# EAGLE design dual-channel-buck-v0 (EAGLE 5.07)

## Sheet 1 of 2
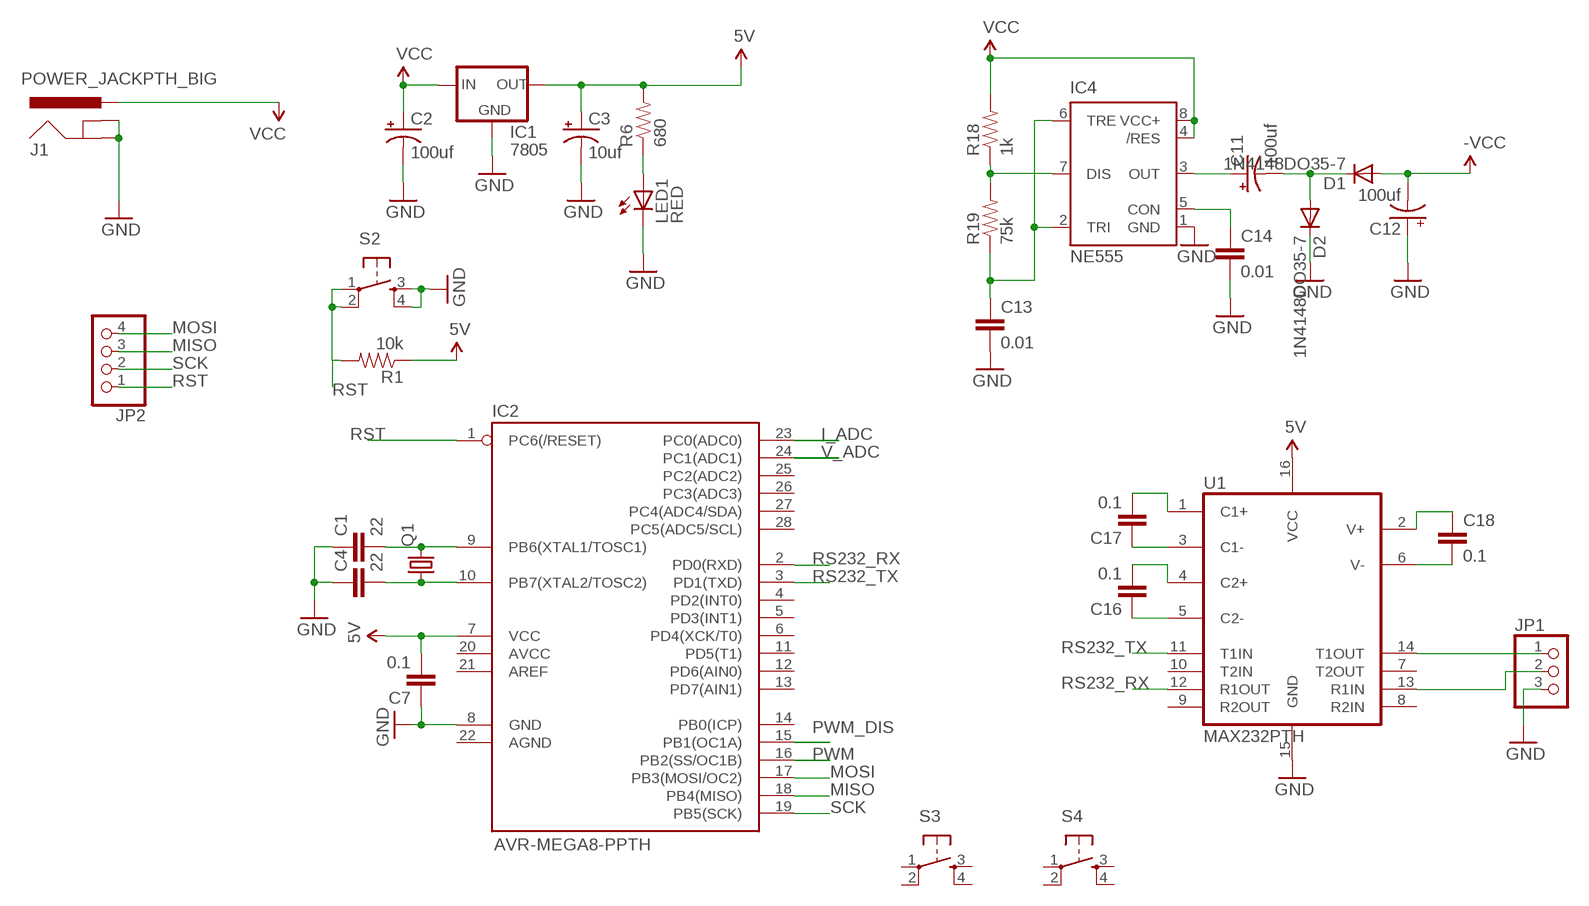
[diagram p0: schematic, sheet 1]

### Parts
C1  22  CAP0805  [0805]
C2  100uf  CAP_POLPTH1  [CPOL-RADIAL-100UF-25V]
C3  10uf  CAP_POLPTH2  [CPOL-RADIAL-10UF-25V]
C4  22  CAP0805  [0805]
C7  0.1  CAP0805  [0805]
C11  100uf  CAP_POLPTH1  [CPOL-RADIAL-100UF-25V]
C12  100uf  CAP_POLPTH1  [CPOL-RADIAL-100UF-25V]
C13  0.01  CAP0805  [0805]
C14  0.01  CAP0805  [0805]
C16  0.1  CAP0805  [0805]
C17  0.1  CAP0805  [0805]
C18  0.1  CAP0805  [0805]
D1  1N4148DO35-7  [DO35-7]
D2  1N4148DO35-7  [DO35-7]
IC1  7805  V_REG_78XXSIDE  [78XXL]
IC2  AVR-MEGA8-PPTH  [DIL28-3]
IC4  NE555  [DIL-08]
J1  POWER_JACKPTH_BIG  [POWER_JACK_2.1X5.5_BIG_PTH]
JP1  PINHD-1X3  [1X03]
JP2  PINHD-1X4  [1X04]
LED1  RED  LED3MM  [LED3MM]
Q1  CRYSTALHC49US  [HC49US]
R1  10k  RESISTOR  [0805]
R6  680  RESISTOR  [0805]
R18  1k  RESISTOR  [0805]
R19  75k  RESISTOR  [0805]
S2  TAC_SWITCHPTH  [TACTILE-PTH]
S3  TAC_SWITCHPTH  [TACTILE-PTH]
S4  TAC_SWITCHPTH  [TACTILE-PTH]
U1  MAX232PTH  [DIL16]

### Nets
5V: C3.1(+) C7.2 IC1.OUT IC2.7(VCC) R1.1 R6.2 U1.16(VCC)
-VCC: C12.2(-) D1.A ; also sheet 2
GND: C1.1 C2.2(-) C3.2(-) C4.1 C7.1 C12.1(+) C13.2 C14.2 D2.C IC1.GND IC2.8(GND) IC4.1(GND) J1.GND J1.GNDBREAK JP1.3 LED1.K(C) S2.3 S2.4 U1.15(GND) ; also sheet 2
I_ADC: IC2.23(PC0(ADC0)) ; also sheet 2
MISO: IC2.18(PB4(MISO)) JP2.3
MOSI: IC2.17(PB3(MOSI/OC2)) JP2.4
N$2: C1.2 IC2.9(PB6(XTAL1/TOSC1)) Q1.2
N$3: C4.2 IC2.10(PB7(XTAL2/TOSC2)) Q1.1
N$10: LED1.A R6.1
N$11: IC4.7(DIS) R18.1 R19.2
N$12: C13.1 IC4.2(TRI) IC4.6(TRE) R19.1
N$14: C14.1 IC4.5(CON)
N$19: C11.1(+) IC4.3(OUT)
N$23: C11.2(-) D1.C D2.A
N$24: C17.2 U1.1(C1+)
N$25: C17.1 U1.3(C1-)
N$28: C16.2 U1.4(C2+)
N$29: C16.1 U1.5(C2-)
N$30: C18.1 U1.2(V+)
N$31: C18.2 U1.6(V-)
N$32: JP1.1 U1.14(T1OUT)
N$33: JP1.2 U1.13(R1IN)
PWM: IC2.16(PB2(SS/OC1B)) ; also sheet 2
PWM_DIS: IC2.15(PB1(OC1A)) ; also sheet 2
RS232_RX: IC2.2(PD0(RXD)) U1.12(R1OUT)
RS232_TX: IC2.3(PD1(TXD)) U1.11(T1IN)
RST: IC2.1(PC6(/RESET)) JP2.1 R1.2 S2.1 S2.2
SCK: IC2.19(PB5(SCK)) JP2.2
V_ADC: IC2.24(PC1(ADC1)) ; also sheet 2
VCC: C2.1(+) IC1.IN IC4.4(/RES) IC4.8(VCC+) J1.PWR R18.2 ; also sheet 2
Unconnected: IC2.4(PD2(INT0)) IC2.5(PD3(INT1)) IC2.6(PD4(XCK/T0)) IC2.11(PD5(T1)) IC2.12(PD6(AIN0)) IC2.13(PD7(AIN1)) IC2.14(PB0(ICP)) IC2.20(AVCC) IC2.21(AREF) IC2.22(AGND) IC2.25(PC2(ADC2)) IC2.26(PC3(ADC3)) IC2.27(PC4(ADC4/SDA)) IC2.28(PC5(ADC5/SCL)) S3.1 S3.2 S3.3 S3.4 S4.1 S4.2 S4.3 S4.4 U1.7(T2OUT) U1.8(R2IN) U1.9(R2OUT) U1.10(T2IN)

## Sheet 2 of 2
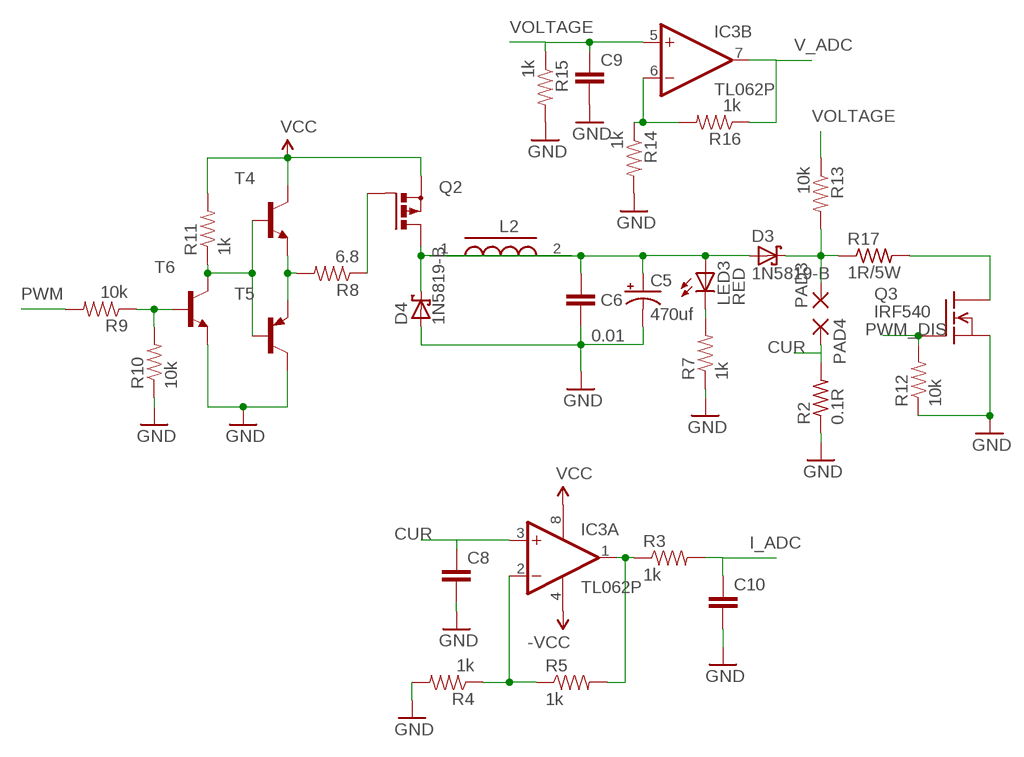
[diagram p1: schematic, sheet 2]

### Parts
C5  470uf  CAP_POLPTH1  [CPOL-RADIAL-100UF-25V]
C6  0.01  CAP0805  [0805]
C8  CAP0805  [0805]
C9  CAP0805  [0805]
C10  CAP0805  [0805]
D3  1N5819-B  [DO41-7.6]
D4  1N5819-B  [DO41-7.6]
IC3  TL062P  [DIL08]
L2  INDUCTOR-IED16  [ED16]
LED3  RED  LED3MM  [LED3MM]
PAD3  2,54/1,1  [2,54/1,1]
PAD4  2,54/1,1  [2,54/1,1]
Q2  PMOSFET_PTO220BH  [TO220BH]
Q3  IRF540  [TO220]
R2  0.1R  R-US_0414/15  [0414/15]
R3  1k  RESISTORPTH1  [AXIAL-0.3]
R4  1k  RESISTOR  [0805]
R5  1k  RESISTOR  [0805]
R7  1k  RESISTOR  [0805]
R8  6.8  RESISTORPTH1  [AXIAL-0.3]
R9  10k  RESISTORPTH1  [AXIAL-0.3]
R10  10k  RESISTORPTH1  [AXIAL-0.3]
R11  1k  RESISTOR  [0805]
R12  10k  RESISTOR  [0805]
R13  10k  RESISTOR  [0805]
R14  1k  RESISTOR  [0805]
R15  1k  RESISTOR  [0805]
R16  1k  RESISTOR  [0805]
R17  1R/5W  R-US_0414/15  [0414/15]
T4  -NPN-SOT23-EBC  [SOT23-EBC]
T5  -PNP-SOT23-EBC  [SOT23-EBC]
T6  -NPN-SOT23-EBC  [SOT23-EBC]

### Nets
-VCC: IC3.4(P:V-) ; also sheet 1
CUR: C8.1 IC3.3(A:+IN) PAD4.1(P) R2.2
GND: C5.2(-) C6.2 C8.2 C9.2 C10.2 D4.A Q3.3(S) R2.1 R4.2 R7.1 R10.P$1 R12.1 R14.2 R15.2 T5.C T6.E ; also sheet 1
I_ADC: C10.1 R3.P$2 ; also sheet 1
N$1: D3.C PAD3.1(P) R13.2 R17.1
N$4: Q3.2(D) R17.2
N$5: IC3.2(A:-IN) R4.1 R5.1
N$6: IC3.1(A:OUT) R3.P$1 R5.2
N$7: IC3.6(B:-IN) R14.1 R16.2
N$9: R9.P$1 R10.P$2 T6.B
N$16: R11.1 T4.B T5.B T6.C
N$17: R8.P$2 T4.E T5.E
N$18: LED3.K(C) R7.2
N$20: Q2.G R8.P$1
N$21: C5.1(+) C6.1 D3.A L2.1 LED3.A
N$22: D4.C L2.2 Q2.D
PWM: R9.P$2 ; also sheet 1
PWM_DIS: Q3.1(G) R12.2 ; also sheet 1
V_ADC: IC3.7(B:OUT) R16.1 ; also sheet 1
VCC: IC3.8(P:V+) Q2.S R11.2 T4.C ; also sheet 1
VOLTAGE: C9.1 IC3.5(B:+IN) R13.1 R15.1

## Library data of the parts
C1 C4 C6-C10 C13 C14 C16-C18 = SparkFun:CAP: Capacitor Standard 0603 ceramic capacitor, and 0.1" leaded capacitor.
C2 C3 C5 C11 C12 = SparkFun:CAP_POL: Capacitor Polarized These are standard SMD and PTH capacitors. Normally 10uF, 47uF, and 100uF in electrolytic and tantalum varieties. Always verify the external diameter of the through hole cap, it varies with capacity, voltage, and manufacturer. The EIA devices should be standard.
D1 D2 = diode:1N4148: DIODE high speed (Philips)
D3 D4 = diode:1N581*: 1.0A SCHOTTKY BARRIER RECTIFIER Source: http://www.diodes.com/datasheets/ds23001.pdf
IC1 = SparkFun:V_REG_78XX: Voltage Regulator Standard 7805 5V regulator. IGO (Input Ground Output). Spark Fun Electronics SKU : COM-00107
IC2 = SparkFun:AVR-MEGA8-P: MICROCONTROLLER 8 Kbytes FLASH 1 kbytes SRAM 512 bytes EEPROM USART 4-channel 10 bit ADC 2-channel 8 bit ADC
IC3 = linear:TL062: OP AMP
IC4 = st-microelectronics:NE555: General purpose bipolar Timer
J1 = digital-toy:POWER_JACK: Power Jack This is the standard 5.5mm barrel jack for power. The PTH is the most common, proven, reliable, footprint. All others are experimental. The Slot footprint only works if the mill layer is transmitted to the PCB fab house so be warned. Spark Fun Electronics SKU : PRT-00119. Mating wall wart : TOL-00298 (and others)
JP1 = pinhead:PINHD-1X3: PIN HEADER
JP2 = pinhead:PINHD-1X4: PIN HEADER
L2 = digital-toy:INDUCTOR-I: Inductors with Iron
LED1 LED3 = SparkFun:LED: LEDs Standard schematic elements and footprints for 5mm, 3mm, 1206, and 0603 sized LEDs. 5mm - Spark Fun Electronics SKU : COM-00529 (and others)
PAD3 PAD4 = wirepad:2,54/1,1: THROUGH-HOLE PAD
Q1 = SparkFun:CRYSTAL: Crystals Various standard crystals. Proven footprints. Spark Fun Electronics SKU : COM-00534
Q2 = transistor-power:PMOSFET_P: Power MOSFET P-Channel
Q3 = transistor-fet:IRF540: N-Channel Enhancement MOSFET (HEXFET); 100V; 28A; 0,077Ohm
R1 R3-R16 R18 R19 = SparkFun:RESISTOR: Resistor Basic schematic elements and footprints for 0603, 1206, and PTH 1/10th watt (small) resistors.
R2 R17 = rcl:R-US_: RESISTOR, American symbol
S2-S4 = SparkFun:TAC_SWITCH: Momentary Switch Button commonly used for reset or general input. Spark Fun Electronics SKU : COM-00097
T4 T6 = digital-toy:*-NPN-: NPN Transistror
T5 = digital-toy:*-PNP-: PNP Transistror
U1 = SparkFun:MAX232: RS232 Transceiver Very common IC. This is generically called 'MAX232', but works with the 3V equivalent MAX3232 generic ICs. Field tested and mother approved. Spark Fun Electronics SKU : COM-00316 (DIP) and COM-00589 (SMD)

## Board
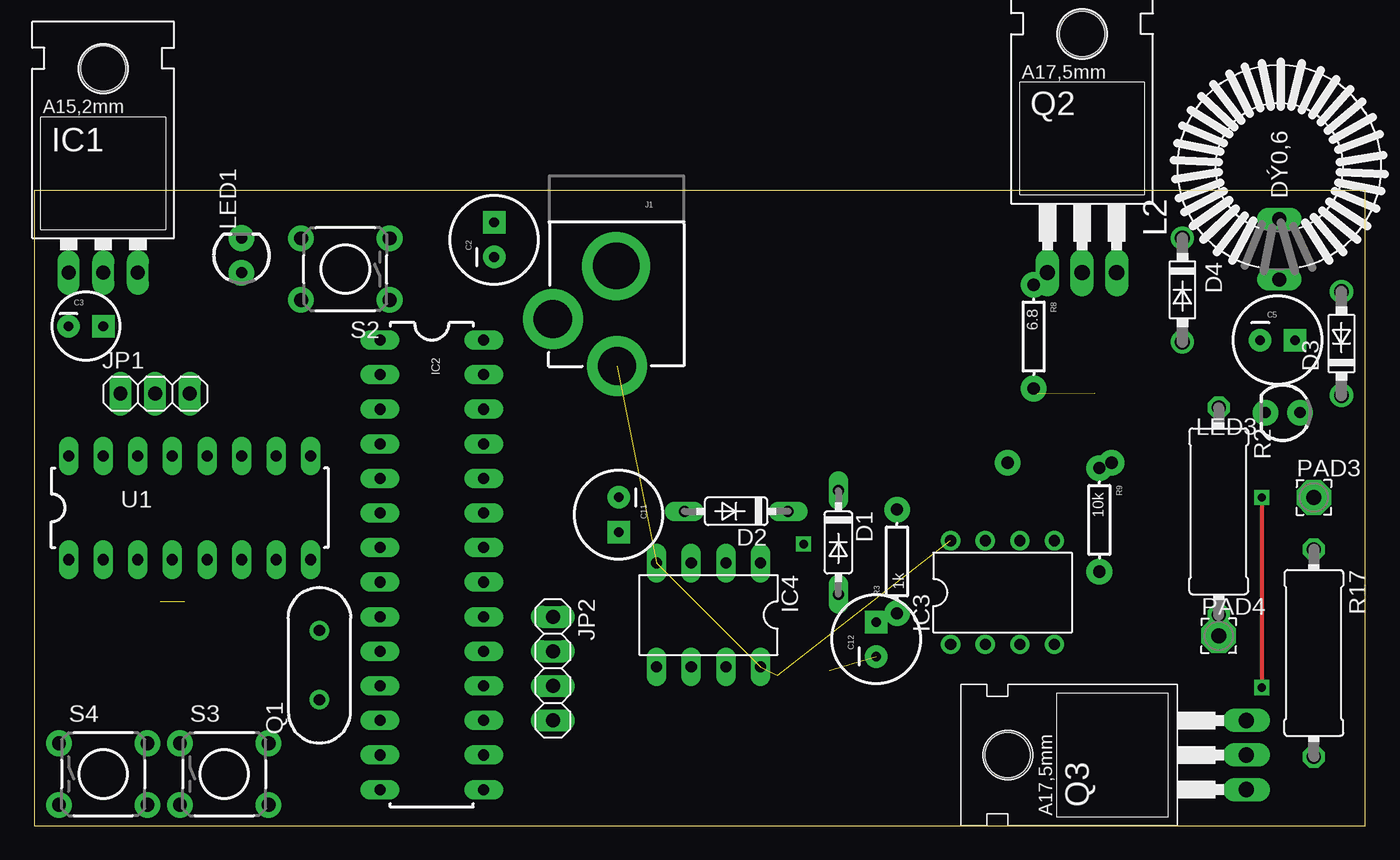
[diagram p2: board, top side]
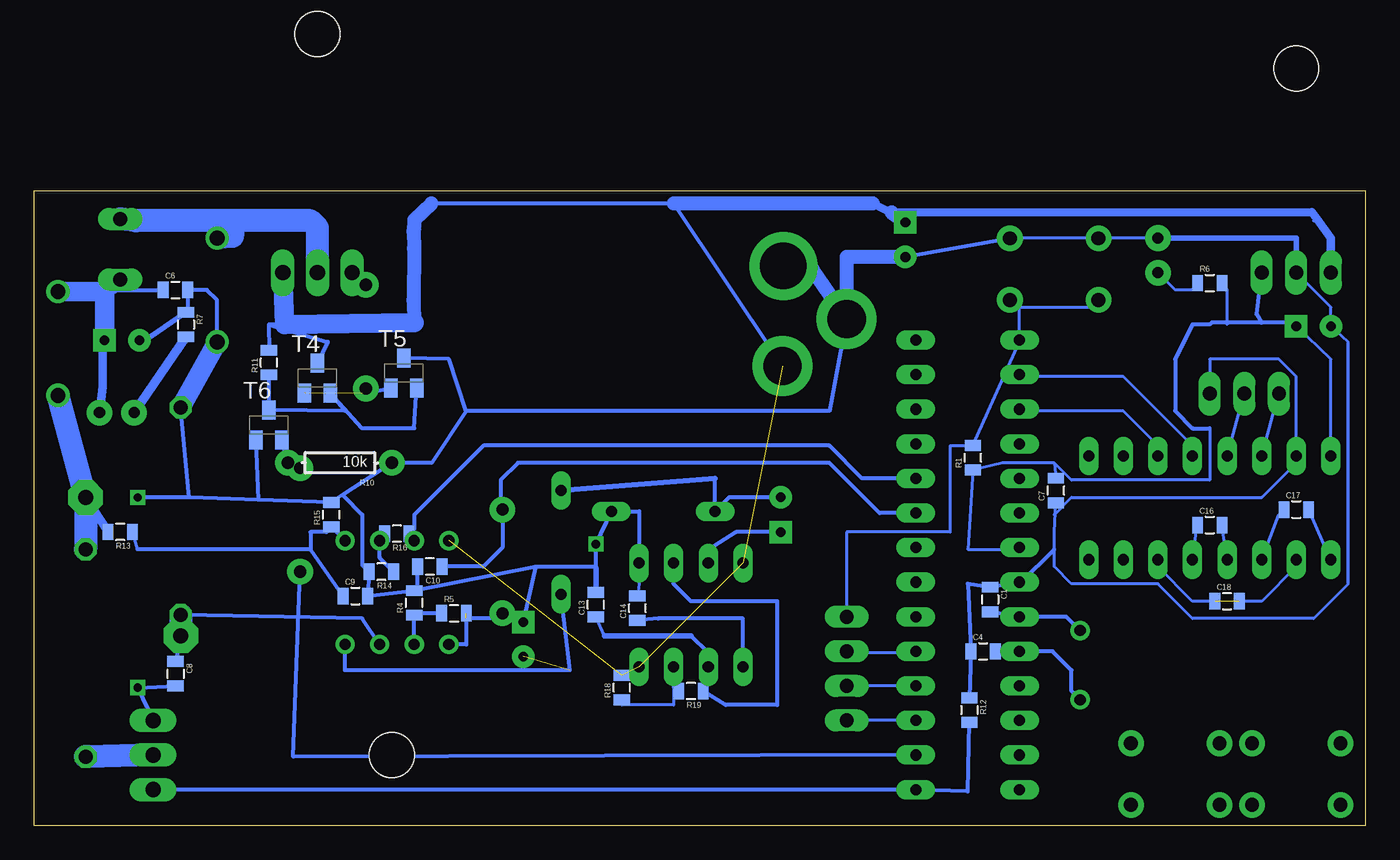
[diagram p3: board, bottom side, seen from below]

Size 97.77 x 46.66 mm. Coordinates in mm from the lower left corner, seen from the top.
Outline: 0,0 97.77,0 97.77,46.66 0,46.66 0,0
Copper layers (1*16): Top 0.035mm / dielectric 1.5mm / Bottom 0.035mm
Design rules "SparkFun-diy": minimum track width 8mil, minimum drill 20mil, track to track 10mil, track to pad 10mil, pad to pad 10mil, via to via 10mil, smd to smd 10mil, copper to edge 10mil, drill to drill 8mil, minimum pad ring 12mil, minimum via ring 10mil, stop-mask expansion 4mil, vias tented up to drill 25mil, thermal gap 10mil

### Footprints (pad centres in the part's own frame; a part is rotated, then mirrored left to right if it is on the bottom)
0805 = smd 0.8 x 1.2: 1 -0.9,0; 2 0.9,0
CPOL-RADIAL-100UF-25V = drill 0.7 pad 1.651 square: 1 1.27,0 | drill 0.7 pad 1.651 round: 2 -1.27,0
CPOL-RADIAL-10UF-25V = drill 0.7 pad 1.651 square: 1 1.27,0 | drill 0.7 pad 1.651 round: 2 -1.27,0
DO35-7 = drill 0.813 long: A 3.81,0; C -3.81,0
DO41-7.6 = drill 1.1 pad 1.7 round: A 3.81,0; C -3.81,0
78XXL = drill 1.016 long: GND 0,-3.81; IN -2.54,-3.81; OUT 2.54,-3.81 | hole 3.302: 0,11.176
DIL28-3 = drill 0.813 long: 1 -16.51,-3.81; 2 -13.97,-3.81; 3 -11.43,-3.81; 4 -8.89,-3.81; 5 -6.35,-3.81; 6 -3.81,-3.81; 7 -1.27,-3.81; 8 1.27,-3.81; 9 3.81,-3.81; 10 6.35,-3.81; 11 8.89,-3.81; 12 11.43,-3.81; 13 13.97,-3.81; 14 16.51,-3.81; 15 16.51,3.81; 16 13.97,3.81; 17 11.43,3.81; 18 8.89,3.81; 19 6.35,3.81; 20 3.81,3.81; 21 1.27,3.81; 22 -1.27,3.81; 23 -3.81,3.81; 24 -6.35,3.81; 25 -8.89,3.81; 26 -11.43,3.81; 27 -13.97,3.81; 28 -16.51,3.81
DIL08 = drill 0.813 pad 1.27 round: 1 -3.81,-3.81; 2 -1.27,-3.81; 3 1.27,-3.81; 4 3.81,-3.81; 5 3.81,3.81; 6 1.27,3.81; 7 -1.27,3.81; 8 -3.81,3.81
DIL-08 = drill 0.813 long: 1 -3.81,-3.81; 2 -1.27,-3.81; 3 1.27,-3.81; 4 3.81,-3.81; 5 3.81,3.81; 6 1.27,3.81; 7 -1.27,3.81; 8 -3.81,3.81
POWER_JACK_2.1X5.5_BIG_PTH = drill 3.4 pad 5 round: GND -0.053,7.35 | drill 2.8 pad 4.4 round: GNDBREAK -4.7,3.451; PWR 0,0
1X03 = drill 1.016 long: 1 -2.54,0; 2 0,0; 3 2.54,0
1X04 = drill 1.016 long: 1 -3.81,0; 2 -1.27,0; 3 1.27,0; 4 3.81,0
ED16 = drill 1.016 long: 1 -8.255,0; 2 -3.81,0
LED3MM = drill 0.813 pad 1.88 round: A -1.27,0; K 1.27,0
2,54/1,1 = drill 1.118 pad 2.54 octagon: 1 0,0
HC49US = drill 0.813 round: 1 -2.54,0; 2 2.54,0
TO220BH = drill 1.118 long: D 0,-6.35; G -2.54,-6.35; S 2.54,-6.35 | hole 3.302: 0,11.176
TO220 = drill 1.118 long: 1 -2.54,-6.35; 2 0,-6.35; 3 2.54,-6.35 | hole 3.302: 0,11.176
0414/15 = drill 1.016 octagon: 1 -7.62,0; 2 7.62,0
AXIAL-0.3 = drill 0.9 pad 1.88 round: P$1 -3.81,0; P$2 3.81,0
TACTILE-PTH = drill 1.016 pad 1.88 round: 1 -3.251,2.261; 2 3.251,2.261; 3 -3.251,-2.261; 4 3.251,-2.261
SOT23-EBC = smd 1 x 1.4: B 0.95,-1.1; C 0,1.1; E -0.95,-1.1
DIL16 = drill 0.813 long: 1 -8.89,-3.81; 2 -6.35,-3.81; 3 -3.81,-3.81; 4 -1.27,-3.81; 5 1.27,-3.81; 6 3.81,-3.81; 7 6.35,-3.81; 8 8.89,-3.81; 9 8.89,3.81; 10 6.35,3.81; 11 3.81,3.81; 12 1.27,3.81; 13 -1.27,3.81; 14 -3.81,3.81; 15 -6.35,3.81; 16 -8.89,3.81

### Placement (x,y rotation side)
C1  27.56,16.64 270 bottom
C2  33.78,43.05 90 top
C3  3.81,36.7 0 top
C4  28.07,12.83 0 bottom
C5  91.31,35.69 0 top
C6  87.38,39.37 0 bottom
C7  22.73,24.64 90 bottom
C8  87.38,11.18 270 bottom
C9  74.17,16.89 0 bottom
C10  68.71,19.05 180 bottom
C11  42.93,22.86 270 top
C12  61.85,13.72 90 top
C13  56.52,16.26 90 bottom
C14  53.47,16 90 bottom
C16  11.43,22.1 0 bottom
C17  5.08,23.24 0 bottom
C18  10.16,16.51 0 bottom
D1  59.05,20.83 270 top
D2  51.56,23.11 180 top
D3  96.01,35.43 90 top
D4  84.33,39.37 270 top
IC1  5.08,44.45 0 top
IC2  29.21,19.18 270 top
IC3  71.12,17.14 0 top
IC4  49.53,15.49 180 top
J1  42.8,33.78 0 top
JP1  8.89,31.75 0 top
JP2  38.1,11.56 270 top
L2  91.44,48.39 90 top
LED1  15.24,41.91 90 top
LED3  91.69,30.35 180 top
PAD3  93.98,24.13 0 top
PAD4  87,13.97 0 top
Q1  20.95,11.81 90 top
Q2  76.96,46.99 0 top
Q3  82.68,5.21 90 top
R1  28.83,27.05 90 bottom
R2  87,23.11 270 top
R3  63.37,19.43 90 top
R4  69.85,16.38 90 bottom
R5  66.93,15.62 0 bottom
R6  11.43,39.88 0 bottom
R7  86.61,36.83 270 bottom
R8  73.41,35.94 270 top
R9  78.23,22.48 270 top
R10  75.31,26.67 180 bottom
R11  80.52,34.04 90 bottom
R12  29.08,8.51 270 bottom
R13  91.44,21.59 180 bottom
R14  72.26,18.67 180 bottom
R15  75.95,22.86 90 bottom
R16  71.12,21.46 180 bottom
R17  93.98,12.7 270 top
R18  54.61,10.16 90 bottom
R19  49.53,9.91 180 bottom
S2  22.86,40.89 180 top
S3  13.97,3.81 0 top
S4  5.08,3.81 0 top
T4  76.96,32.89 0 bottom
T5  70.61,33.27 0 bottom
T6  80.52,29.46 0 bottom
U1  11.43,23.37 0 top

### Tracks (layer width: path | path; a pad name or v marks a point on that pad's centre or on a via)
5V
  Bottom 0.203: IC2.7 25.4,20.32 29.21,20.32 R1.1 26.67,26.67 22.86,26.67 | C3.1 2.54,34.29 U1.16 | 22.86,26.67 21.59,25.4 11.43,25.4 11.43,29.21 | 22.86,26.67 C7.2 | R6.2 10.16,39.37 10.16,36.96 10.16,36.83
  Bottom 0.305: 7.62,36.96 7.99,37.59 IC1.OUT | 11.43,29.21 12.7,29.21 13.97,30.48 13.97,34.29 12.7,36.83 11.43,36.83 11.3,36.96 10.16,36.96 7.62,36.96 | C3.1 5.33,36.96 7.62,36.96
-VCC  (1 unrouted)
  Bottom 0.305: D1.A 58.42,11.43 74.93,11.43 IC3.4
CUR
  Bottom 0.305: IC3.3 73.66,15.24 R2.2 | PAD4.1 C8.1
  Bottom 1.676: R2.2 PAD4.1
GND  (via drill 0.6)
  Top 0.305: v90.17,24.13 v90.17,10.16
  Bottom 0.203: IC1.GND 2.54,38.1 C3.2 1.27,35.56 1.27,17.78 3.81,15.24 12.7,15.24 15.24,17.78 21.59,17.78 22.86,19.05 22.86,20.32 22.86,21.59 C7.1 22.86,22.86 21.59,24.13 7.62,24.13 5.08,26.67 U1.15 5.08,33.02 6.35,34.29 11.43,34.29 JP1.3 | LED1.K 19.05,43.18 S2.4 20.32,43.18 25.4,43.18 S2.3 | 25.4,17.78 IC2.8 | 38.1,39.37 J1.GNDBREAK | C14.2 53.34,17.78 IC4.1 | Q3.3 88.9,7.62
  Bottom 0.305: IC2.8 C1.1 29.21,17.78 C4.1 R12.1 | 22.86,20.32 25.4,17.78 | IC4.1 53.34,23.11 D2.C v56.52,20.7 56.52,19.05 | 56.52,19.05 56.52,18.92 | D4.A 84.33,38.61 85.09,39.37 C6.2 86.48,37.87 R7.1 | S2.3 C2.2 | 60.96,19.05 C12.1 | 60.96,19.05 56.52,19.05 | R4.2 60.96,19.05 | R4.2 C9.2 R14.2 73.66,19.17 73.66,22.86 75.06,24.27 75.06,24.34 | J1.GNDBREAK 39.37,30.48 66.04,30.48 | 66.04,30.48 68.58,26.67 R10.P$1 75.06,24.34 | 66.04,30.48 67.31,34.29 T5.C | 75.06,24.34 R15.2 81.29,23.95 | 81.29,23.95 86.36,24.13 | 86.36,24.13 R2.1 | 81.29,23.95 T6.E | 86.36,24.13 v90.17,24.13 | Q3.3 v90.17,10.16 C8.2 | R4.2 69.61,17.28 C10.2
  Bottom 0.406: R7.1 89.79,35.56 C5.2 | IC1.GND 5.08,43.18 LED1.K | 56.52,18.92 C13.2
  Bottom 1.016: J1.GND 40.6,40.88 J1.GNDBREAK | 38.1,39.37 38.1,41.78 C2.2
  Bottom 1.422: R2.1 D4.A
I_ADC
  Bottom 0.305: IC2.23 35.69,22.99 39.37,26.67 62.23,26.67 63.5,25.4 63.5,23.37 R3.P$2 63.37,20.45 64.77,19.05 C10.1
MISO
  Bottom 0.203: IC2.18 JP2.3
MOSI
  Bottom 0.203: IC2.17 JP2.4
N$1
  Bottom 0.61: R13.2 PAD3.1
  Bottom 1.676: D3.C PAD3.1 R17.1
N$2
  Bottom 0.305: C1.2 IC2.9 21.97,15.37 Q1.2
N$3
  Bottom 0.305: C4.2 IC2.10 22.99,12.83 21.59,11.43 21.59,9.91 Q1.1
N$4
  Bottom 1.676: Q3.2 93.85,5.08 R17.2
N$5
  Bottom 0.305: IC3.2 R4.1 69.85,15.62 R5.1
N$6  (1 unrouted)
  Bottom 0.305: IC3.1 66.04,13.34 66.04,15.24 63.37,15.24 R3.P$1
N$7
  Bottom 0.305: R16.2 72.02,21.32 IC3.6 72.39,19.7 R14.1
N$9
  Bottom 0.305: T6.B R10.P$2 R9.P$1
N$10
  Bottom 0.203: LED1.A 13.97,39.37 12.7,39.37 R6.1
N$11
  Bottom 0.203: 54.61,8.89 50.8,8.89 50.8,10.16 | 50.8,10.16 IC4.7 | 54.61,8.89 54.24,9.14 | 54.61,8.89 R18.1 | R19.2 50.8,10.16
N$12
  Bottom 0.203: 55.88,13.97 C13.1
  Bottom 0.305: 48.26,12.7 49.53,13.97 | IC4.2 50.8,17.78 49.53,16.51 43.18,16.51 43.18,8.89 46.99,8.89 R19.1 IC4.6
  Bottom 0.406: 49.53,13.97 55.88,13.97 | IC4.6 48.26,12.7
N$14
  Bottom 0.305: IC4.5 45.72,15.24 51.93,15.24 C14.1
N$16
  Bottom 0.305: T5.B 69.85,29.21 73.66,29.21 T4.B 74.93,30.48 T6.C R11.1
N$17  (1 unrouted)
  Bottom 0.305: T5.E 73.66,31.75 R8.P$2
N$18
  Bottom 0.61: LED3.K R7.2
N$19
  Bottom 0.305: C11.1 46.23,21.59 48.26,20.32 IC4.3
N$20
  Bottom 1.016: R8.P$1 Q2.G
N$21
  Bottom 0.305: 92.71,39.37 C6.1
  Bottom 0.61: LED3.A 92.71,32.26 92.71,35.05 C5.1
  Bottom 1.422: 92.58,39.24 92.71,39.37 L2.1 | 92.58,39.24 D3.A | C5.1 92.58,39.24
N$22
  Bottom 1.676: Q2.D 76.96,43.94 77.47,44.45 83.19,44.45 | 83.19,44.45 90.3,44.45 L2.2 | D4.C 83.19,43.31 83.19,44.45
N$23
  Bottom 0.305: 47.75,25.53 D2.A 46.74,24.13 C11.2
  Bottom 0.406: 47.75,25.53 D1.C
N$24
  Bottom 0.203: U1.1 C17.2
N$25
  Bottom 0.203: U1.3 6.35,22.86 C17.1
N$28
  Bottom 0.203: U1.4 C16.2
N$29
  Bottom 0.203: U1.5 C16.1
N$30  (1 unrouted)
  Bottom 0.203: 9.26,16.51 7.62,16.51 5.08,19.05 U1.2
N$31  (1 unrouted)
  Bottom 0.203: 11.06,16.51 12.7,16.51 15.24,19.05 U1.6
N$32
  Bottom 0.203: U1.14 JP1.1
N$33
  Bottom 0.203: U1.13 JP1.2
PWM
  Bottom 0.305: IC2.16 78.74,5.08 R9.P$2
PWM_DIS
  Bottom 0.305: R12.2 29.21,2.54 IC2.15 Q3.1
RS232_RX
  Bottom 0.203: U1.12 12.7,27.94 17.78,33.02 25.4,33.02 IC2.2
RS232_TX
  Bottom 0.203: U1.11 15.24,27.94 17.78,30.48 25.4,30.48 IC2.3
RST
  Bottom 0.203: 25.4,38.1 IC2.1 25.4,35.56 R1.2 | 25.4,38.1 20.32,38.1 S2.2 | 25.4,38.1 S2.1 | JP2.1 38.1,21.59 30.48,21.59 30.48,27.94 R1.2 | R1.2 29.21,27.94
SCK
  Bottom 0.203: IC2.19 33.02,12.7 38.1,12.7 JP2.2
V_ADC
  Bottom 0.305: IC2.24 36.96,25.53 39.37,27.94 64.77,27.94 69.85,22.86 69.85,21.83 R16.1 69.85,21.09 IC3.7
VCC  (4 unrouted)
  Bottom 0.203: 3.59,44.61 3.81,44.45 | 69.87,42.42 69.85,41.91
  Bottom 0.305: 79.38,36.83 80.53,36.81 | 80.53,36.81 R11.2 | T4.C 76.2,35.56 80.53,36.81 | 43.18,34.29 50.8,45.72 68.58,45.72
  Bottom 0.61: IC1.IN 2.54,43.18 3.59,44.61 3.94,45.09 34.8,45.05 36.2,45.72
  Bottom 1.016: 69.85,36.96 69.91,38.59 69.87,42.42 69.9,43.69 arc-5 69.85,44.5 68.58,45.72 | 34.8,45.05 C2.1 | 36.2,45.72 50.8,45.72 | 43.18,34.29 J1.PWR
  Bottom 1.422: 69.85,36.96 79.38,36.83 Q2.S
VOLTAGE
  Bottom 0.203: 90.17,20.32 R13.1
  Bottom 0.305: C9.1 77.47,20.32 | 77.47,20.32 90.17,20.32 | IC3.5 75.94,21.96 R15.1 76.32,21.59 77.47,21.59 77.47,20.32